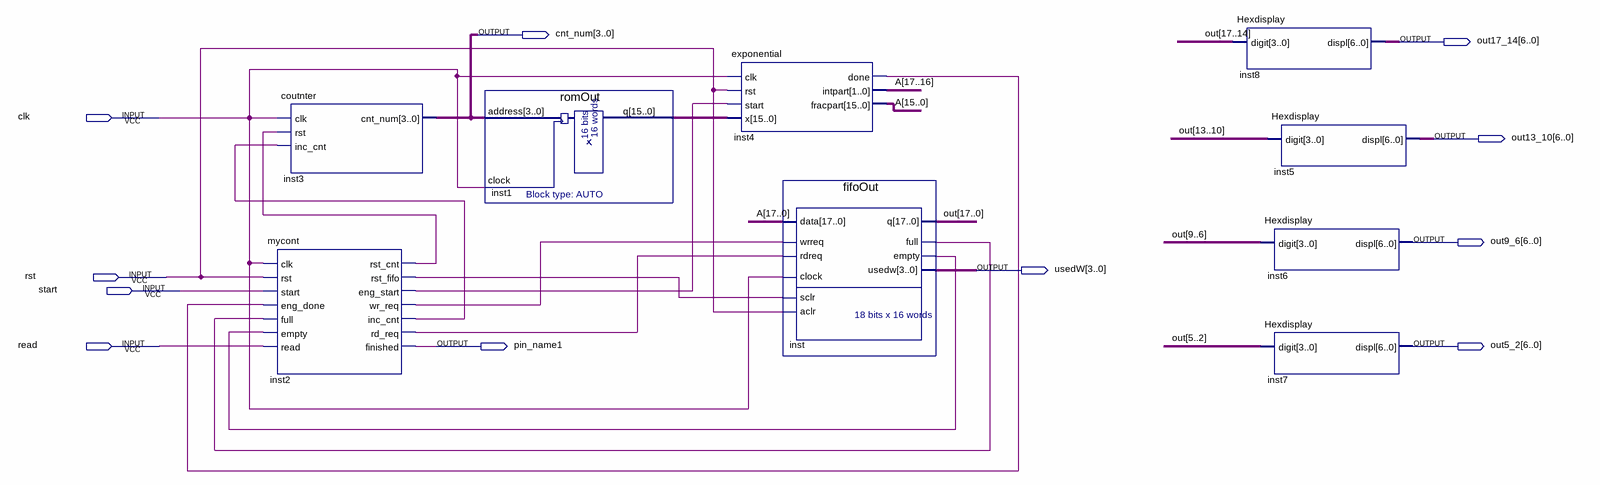
[diagram p0: schematic sheet]
// Quartus schematic exp1.bdf as structural Verilog: 9 symbols, 11 pins
module exp1 (
  input  clk,
  input  rst,
  input  start,
  input  read,
  output [3:0] cnt_num,
  output [6:0] out17_14,
  output [6:0] out13_10,
  output [6:0] out9_6,
  output [3:0] usedW,
  output pin_name1,
  output [6:0] out5_2
);

  wire inst2_eng_start, inst2_inc_cnt, inst2_rd_req, inst2_rst_cnt, inst2_rst_fifo, inst2_wr_req, inst4_done,
       inst_empty, inst_full;
  wire [15:0] inst1_q;
  wire [17:0] A, out;

  mycont inst2 (
    .clk(clk), .rst(rst), .start(start), .eng_done(inst4_done), .full(inst_full), .empty(inst_empty),
    .read(read), .rst_cnt(inst2_rst_cnt), .rst_fifo(inst2_rst_fifo), .eng_start(inst2_eng_start),
    .wr_req(inst2_wr_req), .inc_cnt(inst2_inc_cnt), .rd_req(inst2_rd_req), .finished(pin_name1));
  coutnter inst3 (.clk(clk), .rst(inst2_rst_cnt), .inc_cnt(inst2_inc_cnt), .cnt_num(cnt_num));
  romOut inst1 (.address(cnt_num), .clock(clk), .q(inst1_q));
  exponential inst4 (
    .clk(clk), .rst(rst), .start(inst2_eng_start), .x(inst1_q), .done(inst4_done), .intpart(A[17:16]),
    .fracpart(A[15:0]));
  fifoOut inst (
    .data(A), .wrreq(inst2_wr_req), .rdreq(inst2_rd_req), .clock(clk), .sclr(inst2_rst_fifo), .aclr(rst),
    .q(out), .full(inst_full), .empty(inst_empty), .usedw(usedW));
  Hexdisplay inst8 (.digit(out[17:14]), .displ(out17_14));
  Hexdisplay inst5 (.digit(out[13:10]), .displ(out13_10));
  Hexdisplay inst6 (.digit(out[9:6]), .displ(out9_6));
  Hexdisplay inst7 (.digit(out[5:2]), .displ(out5_2));
endmodule
